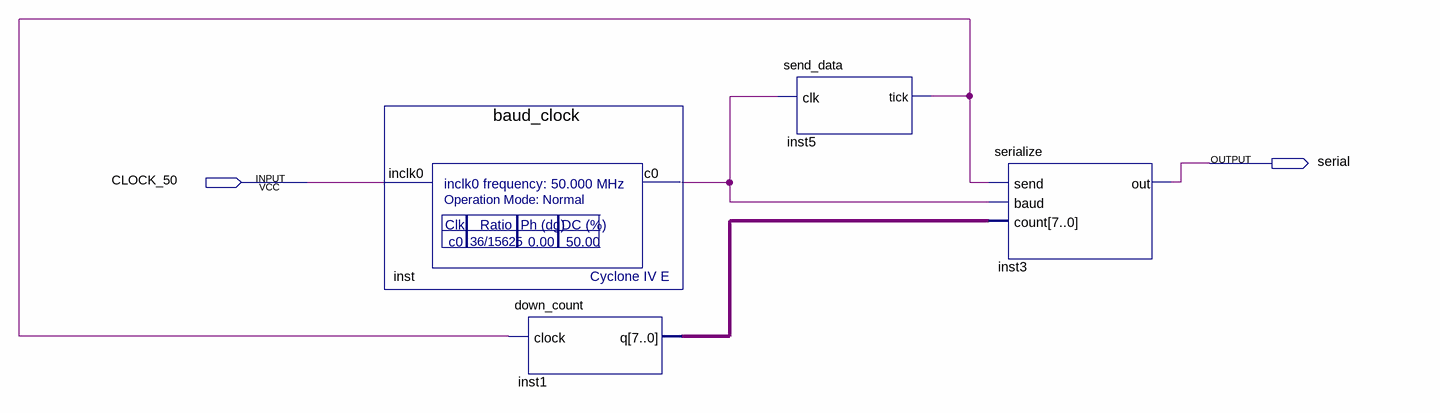
[diagram p0: schematic sheet]
// Quartus schematic serializer.bdf as structural Verilog: 4 symbols, 2 pins
module serializer (
  input  CLOCK_50,
  output serial
);

  wire inst5_tick, inst_c0;
  wire [7:0] inst1_q;

  baud_clock inst (.inclk0(CLOCK_50), .c0(inst_c0));
  down_count inst1 (.clock(inst5_tick), .q(inst1_q));
  send_data inst5 (.clk(inst_c0), .tick(inst5_tick));
  serialize inst3 (.send(inst5_tick), .baud(inst_c0), .count(inst1_q), .out(serial));
endmodule
